# EAGLE board MSP-EXP432P401R (EAGLE 6.5.0), part 1 of 2
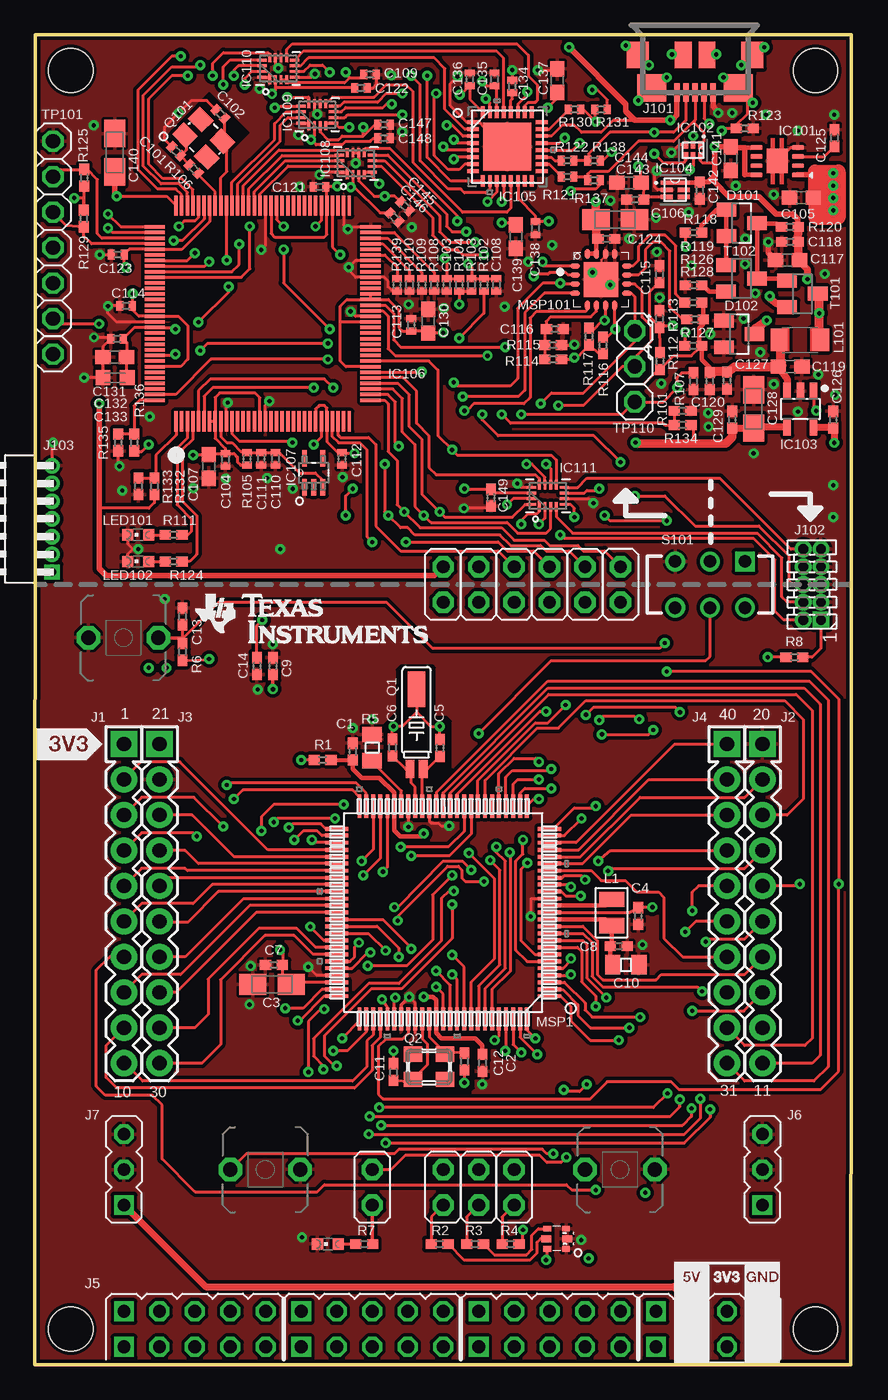
[diagram p7: board, top side]
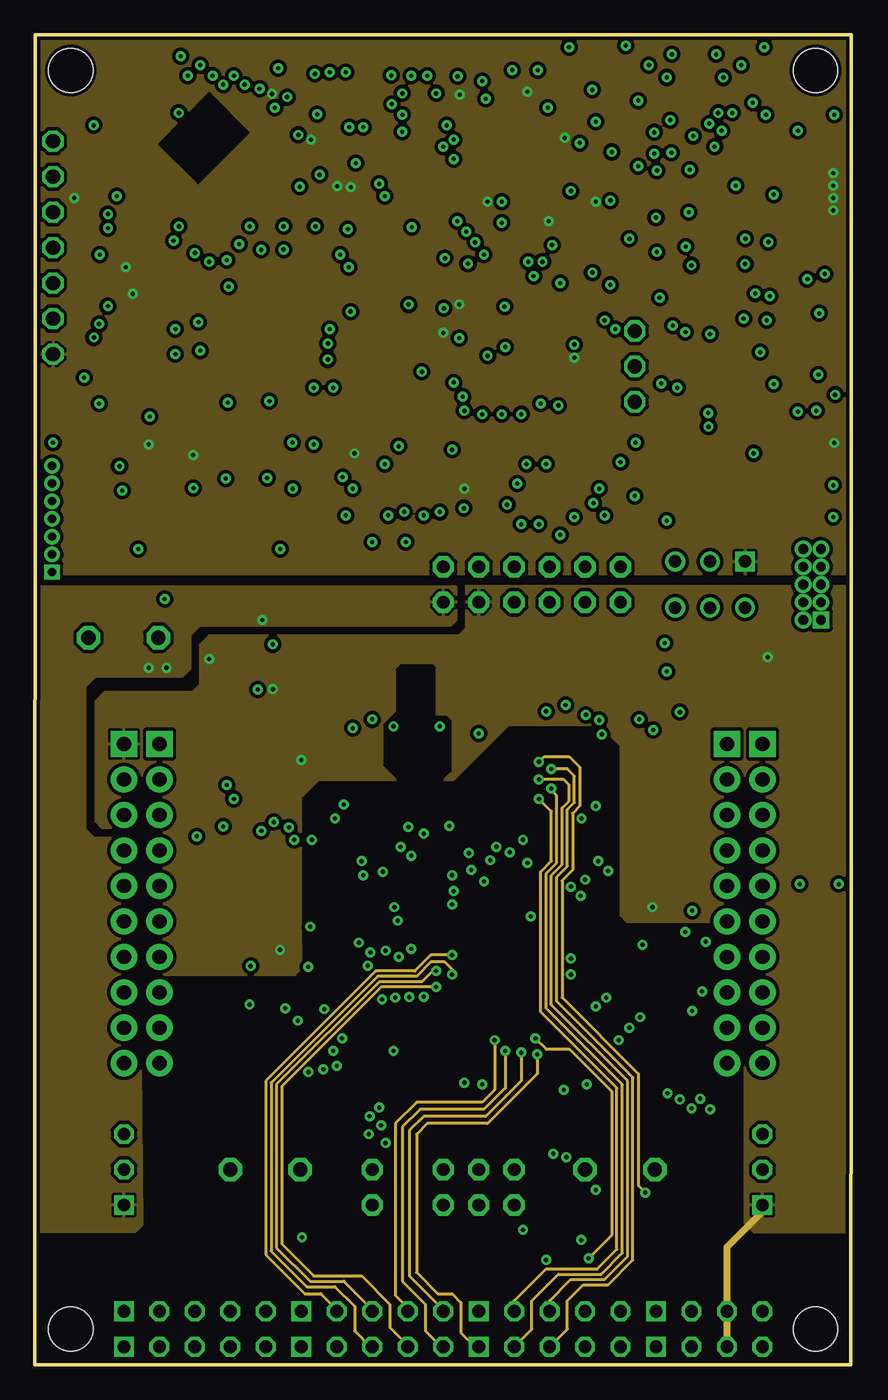
[diagram p8: board, inner layer Mid-Top]
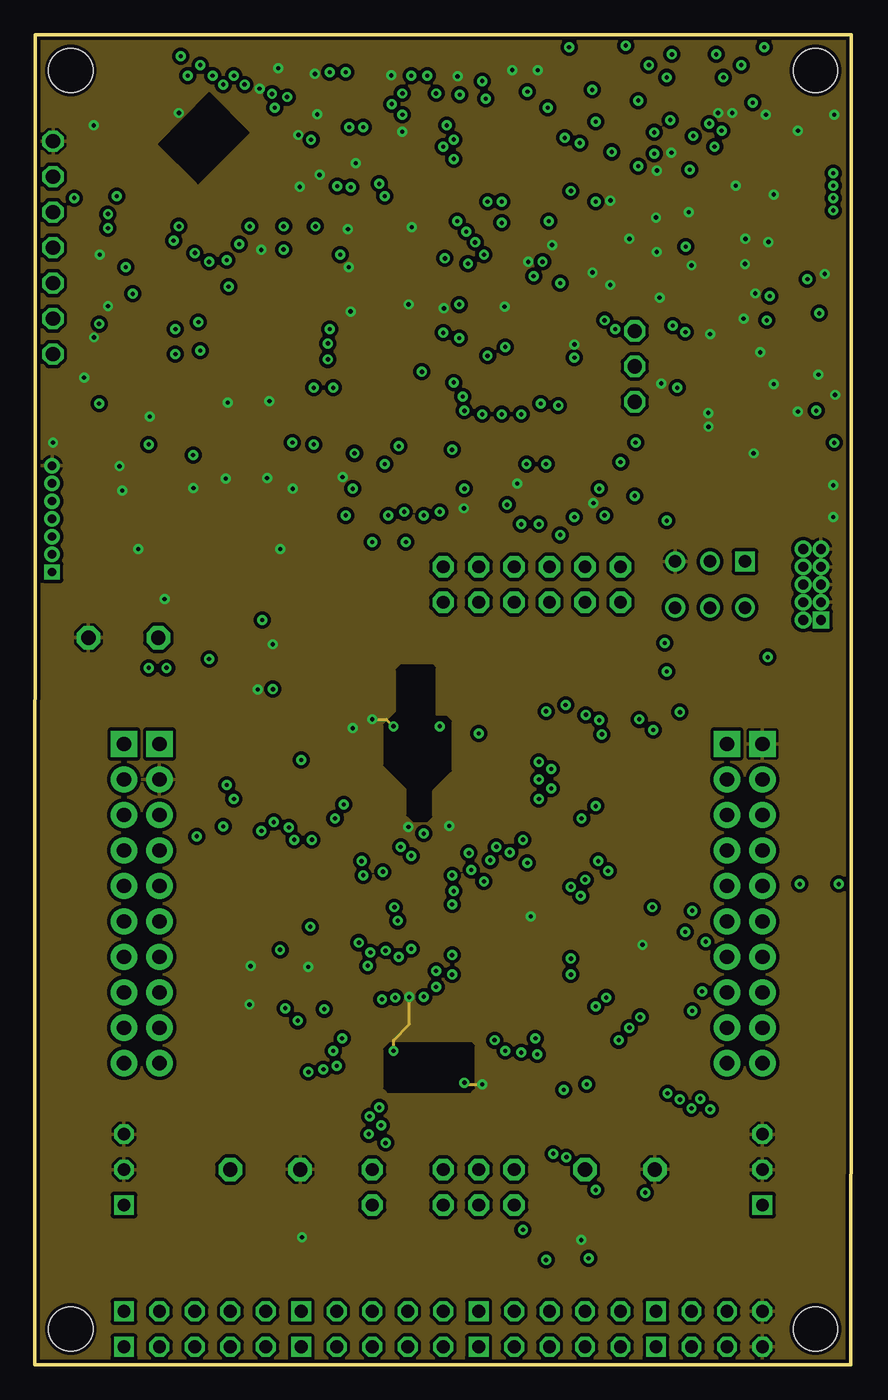
[diagram p9: board, inner layer Mid-Bottom]
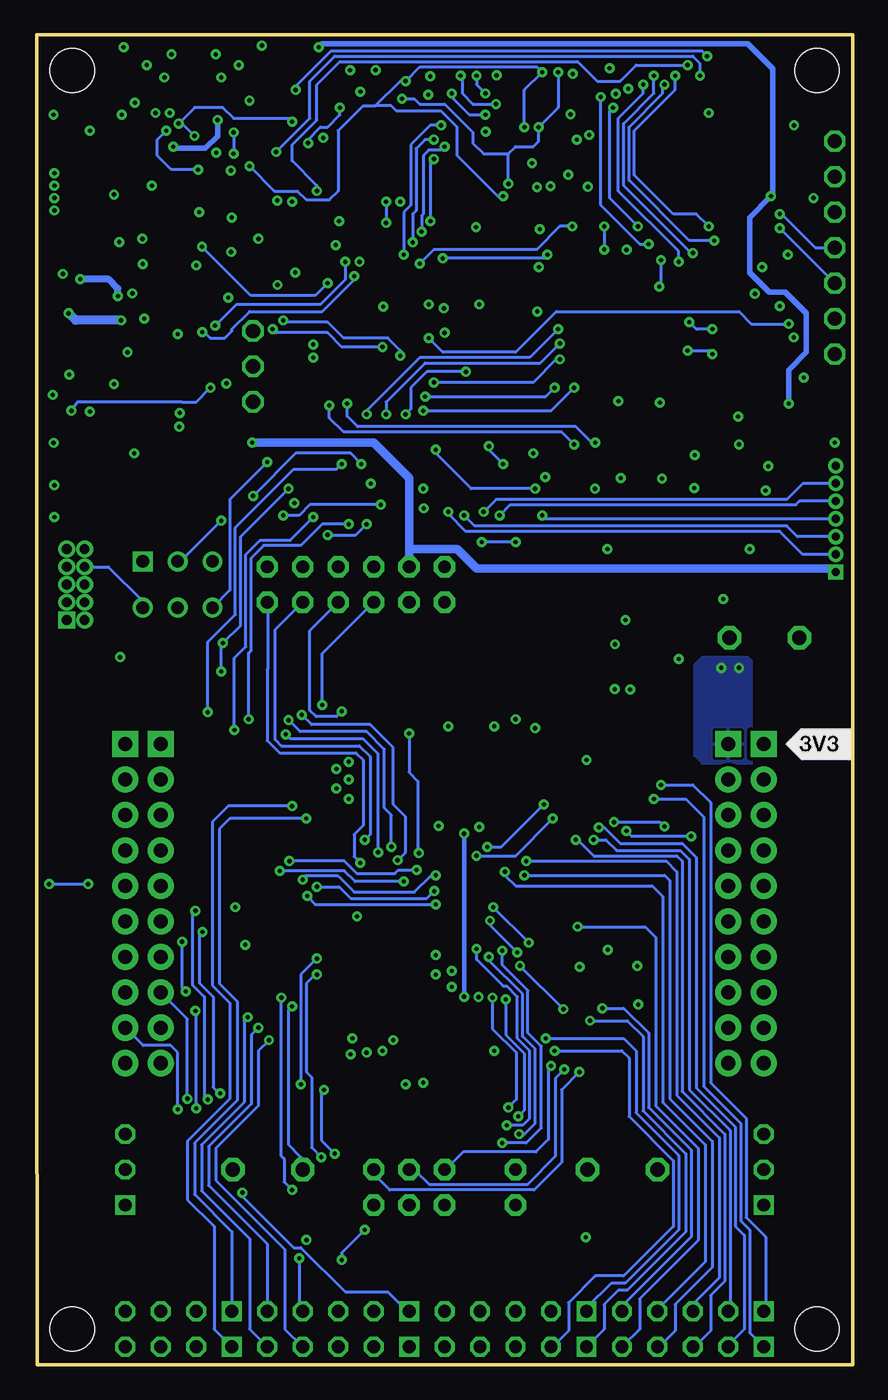
[diagram p10: board, bottom side, seen from below]

Size 58.45 x 95.25 mm. Coordinates in mm from the lower left corner, seen from the top.
Outline: 0,0 58.42,0 58.45,27.3 58.45,95.25 0.03,95.25 0,0
Copper layers (1+2*15+16): Top 0.0178mm / dielectric 12mil / Mid-Top 0.0356mm / dielectric 27mil / Mid-Bottom 0.0356mm / dielectric 12mil / Bottom 0.0178mm
Design rules "MSP430 PCBExpress 4-layer-dietmar": minimum track width 6mil, minimum drill 12mil, track to track 6mil, track to pad 6mil, pad to pad 6mil, via to via 8mil, smd to smd 6mil, copper to edge 8mil, drill to drill 8mil, minimum pad ring 10mil, minimum via ring 8mil, stop-mask expansion 8mil, vias tented up to drill 15mil, thermal gap 8mil
Net classes: 0 default: width 0.254 mm; 1 Ground: width 0.203 mm, drill 0.305 mm, clearance 0.152 mm to class 0, clearance 0.152 mm; 2 Power: width 0.203 mm, drill 0.305 mm, clearance 0.152 mm to class 0, clearance 0.152 mm to class 1, clearance 0.152 mm

## Footprints (pad centres in the part's own frame; a part is rotated, then mirrored left to right if it is on the bottom)
0402 = smd 0.8 x 0.7: 1 -0.6,0; 2 0.6,0
A/3216-18R = smd 1.95 x 1.5: + 1.375,0; - -1.375,0
CSMD0805 = smd 1.092 x 1.397: 1 -0.94,0; 2 0.94,0
C0402 = smd 0.5 x 0.7: 1 -0.45,0; 2 0.45,0
C0603 = smd 1.1 x 1: 1 -0.85,0; 2 0.85,0
C0603K = smd 1.05 x 1.08: 1 -0.875,0; 2 0.875,0
SOT23 = smd 1 x 1.4: 1 -0.95,-1.1; 2 0.95,-1.1; 3 0,1.1
SON8 = smd 0.85 x 0.35: 1 -1.475,0.975; 2 -1.475,0.325; 3 -1.475,-0.325; 4 -1.475,-0.975; 5 1.475,-0.975; 6 1.475,-0.325; 7 1.475,0.325; 8 1.475,0.975 | smd 1.5 x 1.75: 9 0,0
DRY6 = smd 0.559 x 0.305: 1 -0.356,0.508 | smd 0.508 x 0.305: 2 -0.381,0; 3 -0.381,-0.508; 4 0.381,-0.508; 5 0.381,0; 6 0.381,0.508
SOT23-5 = smd 0.55 x 1.2: 1 -1.204,-0.919; 2 -0.254,-0.919; 3 0.696,-0.919; 4 0.696,1.681; 5 -1.204,1.681
DSE6 = smd 0.965 x 0.305: 1 -0.559,0.508 | smd 0.864 x 0.305: 2 -0.61,0; 3 -0.61,-0.508; 4 0.61,-0.508; 5 0.61,0; 6 0.61,0.508
RHB32_3P45X3P45 = smd 0.838 x 0.279: 1 -2.464,1.753; 2 -2.464,1.245; 3 -2.464,0.762; 4 -2.464,0.254; 5 -2.464,-0.254; 6 -2.464,-0.762; 7 -2.464,-1.245; 8 -2.464,-1.753; 17 2.464,-1.753; 18 2.464,-1.245; 19 2.464,-0.762; 20 2.464,-0.254; 21 2.464,0.254; 22 2.464,0.762; 23 2.464,1.245; 24 2.464,1.753 | smd 0.279 x 0.838: 9 -1.753,-2.464; 10 -1.245,-2.464; 11 -0.762,-2.464; 12 -0.254,-2.464; 13 0.254,-2.464; 14 0.762,-2.464; 15 1.245,-2.464; 16 1.753,-2.464; 25 1.753,2.464; 26 1.245,2.464; 27 0.762,2.464; 28 0.254,2.464; 29 -0.254,2.464; 30 -0.762,2.464; 31 -1.245,2.464; 32 -1.753,2.464 | smd 3.454 x 3.454: 33 0,0
TQFP-128 = smd 1.45 x 0.25: P$1 0,0; P$2 0,-0.4; P$3 0,-0.8; P$4 0,-1.2; P$5 0,-1.6; P$6 0,-2; P$7 0,-2.4; P$8 0,-2.8; P$9 0,-3.2; P$10 0,-3.6; P$11 0,-4; P$12 0,-4.4; P$13 0,-4.8; P$14 0,-5.2; P$15 0,-5.6; P$16 0,-6; P$17 0,-6.4; P$18 0,-6.8; P$19 0,-7.2; P$20 0,-7.6; P$21 0,-8; P$22 0,-8.4; P$23 0,-8.8; P$24 0,-9.2; P$25 0,-9.6; P$26 0,-10; P$27 0,-10.4; P$28 0,-10.8; P$29 0,-11.2; P$30 0,-11.6; P$31 0,-12; P$32 0,-12.4; P$65 15.45,-12.4; P$66 15.45,-12; P$67 15.45,-11.6; P$68 15.45,-11.2; P$69 15.45,-10.8; P$70 15.45,-10.4; P$71 15.45,-10; P$72 15.45,-9.6; P$73 15.45,-9.2; P$74 15.45,-8.8; P$75 15.45,-8.4; P$76 15.45,-8; P$77 15.45,-7.6; P$78 15.45,-7.2; P$79 15.45,-6.8; P$80 15.45,-6.4; P$81 15.45,-6; P$82 15.45,-5.6; P$83 15.45,-5.2; P$84 15.45,-4.8; P$85 15.45,-4.4; P$86 15.45,-4; P$87 15.45,-3.6; P$88 15.45,-3.2; P$89 15.45,-2.8; P$90 15.45,-2.4; P$91 15.45,-2; P$92 15.45,-1.6; P$93 15.45,-1.2; P$94 15.45,-0.8; P$95 15.45,-0.4; P$96 15.45,0 | smd 0.25 x 1.45: P$33 1.525,-13.925; P$34 1.925,-13.925; P$35 2.325,-13.925; P$36 2.725,-13.925; P$37 3.125,-13.925; P$38 3.525,-13.925; P$39 3.925,-13.925; P$40 4.325,-13.925; P$41 4.725,-13.925; P$42 5.125,-13.925; P$43 5.525,-13.925; P$44 5.925,-13.925; P$45 6.325,-13.925; P$46 6.725,-13.925; P$47 7.125,-13.925; P$48 7.525,-13.925; P$49 7.925,-13.925; P$50 8.325,-13.925; P$51 8.725,-13.925; P$52 9.125,-13.925; P$53 9.525,-13.925; P$54 9.925,-13.925; P$55 10.325,-13.925; P$56 10.725,-13.925; P$57 11.125,-13.925; P$58 11.525,-13.925; P$59 11.925,-13.925; P$60 12.325,-13.925; P$61 12.725,-13.925; P$62 13.125,-13.925; P$63 13.525,-13.925; P$64 13.925,-13.925; P$97 13.925,1.525; P$98 13.525,1.525; P$99 13.125,1.525; P$100 12.725,1.525; P$101 12.325,1.525; P$102 11.925,1.525; P$103 11.525,1.525; P$104 11.125,1.525; P$105 10.725,1.525; P$106 10.325,1.525; P$107 9.925,1.525; P$108 9.525,1.525; P$109 9.125,1.525; P$110 8.725,1.525; P$111 8.325,1.525; P$112 7.925,1.525; P$113 7.525,1.525; P$114 7.125,1.525; P$115 6.725,1.525; P$116 6.325,1.525; P$117 5.925,1.525; P$118 5.525,1.525; P$119 5.125,1.525; P$120 4.725,1.525; P$121 4.325,1.525; P$122 3.925,1.525; P$123 3.525,1.525; P$124 3.125,1.525; P$125 2.725,1.525; P$126 2.325,1.525; P$127 1.925,1.525; P$128 1.525,1.525
DCK5 = smd 1.168 x 0.356: 1 -1.041,0.66; 2 -1.041,0; 3 -1.041,-0.66; 4 1.041,-0.66; 5 1.041,0.66
RSV16 = smd 0.762 x 0.203: 1 -0.737,0.61 | smd 0.66 x 0.203: 2 -0.787,0.203; 3 -0.787,-0.203; 4 -0.787,-0.61; 9 0.787,-0.61; 10 0.787,-0.203; 11 0.787,0.203; 12 0.787,0.61 | smd 0.203 x 0.66: 5 -0.61,-1.168; 6 -0.203,-1.168; 7 0.203,-1.168; 8 0.61,-1.168; 13 0.61,1.168; 14 0.203,1.168; 15 -0.203,1.168; 16 -0.61,1.168
1X10 = drill 1.016 pad 1.88 square: 1 0,10.16 | drill 1.016 pad 1.88: 2 0,7.62; 3 0,5.08; 4 0,2.54; 5 0,0; 6 0,-2.54; 7 0,-5.08; 8 0,-7.62; 9 0,-10.16; 10 0,-12.7
1X10-J2 = drill 1.016 pad 1.88: 11 0,-12.7; 12 0,-10.16; 13 0,-7.62; 14 0,-5.08; 15 0,-2.54; 16 0,0; 17 0,2.54; 18 0,5.08; 19 0,7.62 | drill 1.016 pad 1.88 square: 20 0,10.16
1X10-J3 = drill 1.016 pad 1.88 square: 21 0,10.16 | drill 1.016 pad 1.88: 22 0,7.62; 23 0,5.08; 24 0,2.54; 25 0,0; 26 0,-2.54; 27 0,-5.08; 28 0,-7.62; 29 0,-10.16; 30 0,-12.7
1X10-J4 = drill 1.016 pad 1.88: 31 0,-12.7; 32 0,-10.16; 33 0,-7.62; 34 0,-5.08; 35 0,-2.54; 36 0,0; 37 0,2.54; 38 0,5.08; 39 0,7.62 | drill 1.016 pad 1.88 square: 40 0,10.16
BOTTOM_CONNECTOR = drill 0.914 square: 1 -24.13,-1.27; 2 -24.13,1.27; 11 -11.43,-1.27; 12 -11.43,1.27; 21 1.27,-1.27; 22 1.27,1.27; 31 13.97,-1.27; 32 13.97,1.27 | drill 0.914 octagon: 3 -21.59,-1.27; 4 -21.59,1.27; 5 -19.05,-1.27; 6 -19.05,1.27; 7 -16.51,-1.27; 8 -16.51,1.27; 9 -13.97,-1.27; 10 -13.97,1.27; 13 -8.89,-1.27; 14 -8.89,1.27; 15 -6.35,-1.27; 16 -6.35,1.27; 17 -3.81,-1.27; 18 -3.81,1.27; 19 -1.27,-1.27; 20 -1.27,1.27; 23 3.81,-1.27; 24 3.81,1.27; 25 6.35,-1.27; 26 6.35,1.27; 27 8.89,-1.27; 28 8.89,1.27; 29 11.43,-1.27; 30 11.43,1.27; 33 16.51,-1.27; 34 16.51,1.27; 35 19.05,-1.27; 36 19.05,1.27; 37 21.59,-1.27; 38 21.59,1.27
JP3 = drill 0.914 square: 1 -2.54,0 | drill 0.914 octagon: 2 0,0; 3 2.54,0
HIROSE-ZX62R-B-5P = smd 1.35 x 0.4: D+ 2.675,0; D- 2.675,-0.65; GND 2.675,1.3; NC 2.675,0.65; VBUS 2.675,-1.3 | smd 1.9 x 1.6: SHIELD1 0,4.1; SHIELD2 0,-4.1 | smd 2 x 2.1: SHIELD3 2.35,3.1; SHIELD4 2.35,-3.1 | smd 1.9 x 1.2: SHIELD5 0,0.85; SHIELD6 0,-0.85
EXTERNAL_DEBUG = drill 0.7 pad 0.93 square: 1 -2.54,-0.635 | drill 0.7 pad 0.93: 2 -2.54,0.635; 3 -1.27,-0.635; 4 -1.27,0.635; 5 0,-0.635; 6 0,0.635; 7 1.27,-0.635; 8 1.27,0.635; 9 2.54,-0.635; 10 2.54,0.635
XDSET_DEBUG = drill 0.6 pad 0.838 square: 1 -3.17,0.07 | drill 0.6 pad 0.838: 2 -1.91,0.07; 3 -0.63,0.07; 4 0.63,0.07; 5 1.91,0.07; 6 3.18,0.07; 7 4.45,0.07
JP1M = drill 0.914 pad 1.524 octagon: 1 0,-1.27; 2 0,1.27
0806 = smd 1.1 x 1.8: 1 -0.94,0; 2 0.94,0
L3216C = smd 1.2 x 1.6: 1 -1.5,0; 2 1.5,0
CHIPLED_0603 = smd 0.8 x 0.8: A 0,-0.75; C 0,0.75
RGB_LED = smd 0.55 x 0.4: 1 -0.675,0.725; 3 -0.675,-0.725; 4 0.675,0.725; 6 0.675,-0.725 | smd 0.7 x 0.5: 2 -0.75,0; 5 0.75,0
PZ100 = smd 1.676 x 0.279: 1 -7.62,5.994; 2 -7.62,5.512; 3 -7.62,5.004; 4 -7.62,4.496; 5 -7.62,3.988; 6 -7.62,3.505; 7 -7.62,2.997; 8 -7.62,2.489; 9 -7.62,2.007; 10 -7.62,1.499; 11 -7.62,0.991; 12 -7.62,0.508; 13 -7.62,0; 14 -7.62,-0.508; 15 -7.62,-0.991; 16 -7.62,-1.499; 17 -7.62,-2.007; 18 -7.62,-2.489; 19 -7.62,-2.997; 20 -7.62,-3.505; 21 -7.62,-3.988; 22 -7.62,-4.496; 23 -7.62,-5.004; 24 -7.62,-5.512; 25 -7.62,-5.994; 51 7.62,-5.994; 52 7.62,-5.512; 53 7.62,-5.004; 54 7.62,-4.496; 55 7.62,-3.988; 56 7.62,-3.505; 57 7.62,-2.997; 58 7.62,-2.489; 59 7.62,-2.007; 60 7.62,-1.499; 61 7.62,-0.991; 62 7.62,-0.508; 63 7.62,0; 64 7.62,0.508; 65 7.62,0.991; 66 7.62,1.499; 67 7.62,2.007; 68 7.62,2.489; 69 7.62,2.997; 70 7.62,3.505; 71 7.62,3.988; 72 7.62,4.496; 73 7.62,5.004; 74 7.62,5.512; 75 7.62,5.994 | smd 0.279 x 1.676: 26 -5.994,-7.62; 27 -5.512,-7.62; 28 -5.004,-7.62; 29 -4.496,-7.62; 30 -3.988,-7.62; 31 -3.505,-7.62; 32 -2.997,-7.62; 33 -2.489,-7.62; 34 -2.007,-7.62; 35 -1.499,-7.62; 36 -0.991,-7.62; 37 -0.508,-7.62; 38 0,-7.62; 39 0.508,-7.62; 40 0.991,-7.62; 41 1.499,-7.62; 42 2.007,-7.62; 43 2.489,-7.62; 44 2.997,-7.62; 45 3.505,-7.62; 46 3.988,-7.62; 47 4.496,-7.62; 48 5.004,-7.62; 49 5.512,-7.62; 50 5.994,-7.62; 76 5.994,7.62; 77 5.512,7.62; 78 5.004,7.62; 79 4.496,7.62; 80 3.988,7.62; 81 3.505,7.62; 82 2.997,7.62; 83 2.489,7.62; 84 2.007,7.62; 85 1.499,7.62; 86 0.991,7.62; 87 0.508,7.62; 88 0,7.62; 89 -0.508,7.62; 90 -0.991,7.62; 91 -1.499,7.62; 92 -2.007,7.62; 93 -2.489,7.62; 94 -2.997,7.62; 95 -3.505,7.62; 96 -3.988,7.62; 97 -4.496,7.62; 98 -5.004,7.62; 99 -5.512,7.62; 100 -5.994,7.62
RSA16 = smd 0.7 x 0.35: 1 -1.85,0.975; 2 -1.85,0.325; 3 -1.85,-0.325; 4 -1.85,-0.975; 9 1.85,-0.975; 10 1.85,-0.325; 11 1.85,0.325; 12 1.85,0.975 | smd 0.35 x 0.7: 5 -0.975,-1.85; 6 -0.325,-1.85; 7 0.325,-1.85; 8 0.975,-1.85; 13 0.975,1.85; 14 0.325,1.85; 15 -0.325,1.85; 16 -0.975,1.85 | smd 2.5 x 2.5: TP 0,0
MS3V-T1R = smd 0.635 x 1.27: P1 -0.47,-4.43; P2 0.47,-4.43 | smd 1.27 x 2.54: P3 0,1.3
KX-7 = smd 1.3 x 1.1: 1 -1.15,-0.9; 2 1.15,-0.9; 3 1.15,0.9; 4 -1.15,0.9
NX3225GA = smd 1.4 x 1.2: 1 0,0; 2 2.2,0; 3 2.2,1.6; 4 0,1.6
0805 = smd 1.092 x 1.397: 1 -0.94,0; 2 0.94,0
R0402 = smd 0.5 x 0.7: 1 -0.45,0; 2 0.45,0
PBTH = drill 1.016 pad 1.676 octagon: 1 -0.001,0.001; 2 5.001,0.001
M096V_DPDT = drill 0.9 square: 1 -2.5,-3.3 | drill 0.9: 2 0,-3.3; 3 2.5,-3.3; 4 -2.5,0; 5 0,0; 6 2.5,0
SOT23-BEC = smd 1 x 1.4: B -0.95,-1.1; C 0,1.1; E 0.95,-1.1
1X01 = drill 1.016 octagon: 1 0,0
MOUNTHOLE_125MIL = hole 3.175: 0,0

## Placement (x,y rotation side)
C1  100n  [0402]  22.76,43.92 90 top
C2  100n  [0402]  32.05,21.62 270 top
C3  10u  [A/3216-18R]  16.98,27.24 0 top
C4  100n  [0402]  43.21,32.13 270 top
C5  12p  [0402]  29.01,44.17 90 top
C6  12p  [0402]  25.6,44.2 90 top
C7  100n  [0402]  17.11,28.64 180 top
C8  100n  [0402]  41.81,29.97 0 top
C9  100n  [0402]  17.04,50.04 270 top
C10  4u7  [CSMD0805]  42.32,28.64 0 top
C11  22p  [0402]  25.68,20.96 90 top
C12  22p  [0402]  30.76,21.72 270 top
C13  1n  [0402]  10.57,53.59 90 top
C14  100n  [0402]  15.9,50.04 90 top
C101  12pF  [C0402]  10.11,86.92 135 top
C102  12pF  [C0402]  13.28,89.59 135 top
C103  0.1uF  [C0402]  29.49,77.34 270 top
C104  10n  [C0402]  13.64,64.82 270 top
C105  2u2  [C0603]  54.89,83.59 180 top
C106  4.7u  [A/3216-18R]  41.55,82.01 180 top
C107  1u  [C0603]  12.45,64.34 270 top
C108  DNP  [C0402]  33.05,77.34 270 top
C109  10n  [C0402]  23.98,92.41 0 top
C110  10n  [C0402]  17.22,64.87 270 top
C111  100n  [C0402]  16.21,64.87 270 top
C112  10n  [C0402]  22,64.9 270 top
C113  100n  [C0402]  26.95,74.49 90 top
C114  10n  [C0402]  6.52,75.84 180 top
C115  33p  [0402]  44.73,78.1 270 top
C116  33p  [0402]  37.24,74.17 180 top
C117  4.7u  [C0603]  53.89,79.13 180 top
C118  100n  [0402]  54.07,80.43 180 top
C119  4.7u  [C0603]  54.08,71.49 0 top
C120  100n  [0402]  48.32,70.45 270 top
C121  100n  [C0402]  20.37,84.36 180 top
C122  10n  [C0402]  23.35,91.45 0 top
C123  10n  [C0402]  5.93,79.5 180 top
C124  100n  [0402]  40.92,80.65 0 top
C125  10n  [0402]  57.25,87.86 90 top
C126  220n  [0402]  57.18,67.69 90 top
C127  220n  [0402]  49.56,70.48 270 top
C128  47u  [A/3216-18R]  51.46,68.45 270 top
C129  100n  [0402]  49.94,67.69 90 top
C130  1u  [C0603]  28.16,74.74 270 top
C131  0.1uF  [C0402]  5.87,73.48 180 top
C132  1u  [C0603]  5.71,72.16 0 top
C133  2.2uF  [C0603K]  5.74,70.69 180 top
C134  100n  [C0402]  34.19,91.57 90 top
C135  100n  [C0402]  32.92,92.08 90 top
C136  100n  [C0402]  31.14,92.08 90 top
C137  2u2  [C0603]  37.4,91.97 90 top
C138  100n  [C0402]  35.84,81.41 270 top
C139  2u2  [C0603]  34.44,80.8 270 top
C140  4.7u  [A/3216-18R]  5.71,86.82 270 top
C141  1u  [C0603]  49.83,86.39 270 top
C142  100n  [0402]  47.6,84.1 270 top
C143  100n  [0402]  42.99,83.45 180 top
C144  2u2  [C0603]  42.55,84.66 180 top
C145  10n  [C0402]  26.5,82.98 315 top
C146  10n  [C0402]  25.72,82.18 315 top
C147  10n  [C0402]  25,88.81 0 top
C148  10n  [C0402]  25,87.85 0 top
C149  100n  [0402]  32.66,62.1 270 top
D101  BAS40-05  [SOT23]  50.61,81.77 270 top
D102  BAS40-05  [SOT23]  50.44,73.82 270 top
DRAW3  [LOGO-ROCKET-10X7MM-BRD]  14.34,43.13 7 top
IC101  TPS73533DRB  [SON8]  53.16,86.21 180 top
IC102  TPD4E004_DRY_6  [DRY6]  47.13,86.99 270 top
IC103  TPS2102DBV  [SOT23-5]  54.56,68.83 180 top
IC104  TLV70018_DSE_6  [DSE6]  45.85,84.15 0 top
IC105  TUSB1210_RHB_32  [RHB32_3P45X3P45]  33.83,87.25 0 top
IC106  TM4C129ENCPDT  [TQFP-128]  10.11,67.56 90 top
IC107  LM4040B25_DCK_5  [DCK5]  19.96,63.88 90 top
IC108  SN74AVC4T245_RSV_16  [RSV16]  22.98,86.03 90 top
IC109  SN74AVC4T245_RSV_16  [RSV16]  20.22,89.54 90 top
IC110  SN74AVC4T245_RSV_16  [RSV16]  17.42,92.84 90 top
IC111  SN74CBTLV3257_RSV_16  [RSV16]  36.73,62.23 90 top
J1  [1X10]  6.38,34.29 0 top
J2  [1X10-J2]  52.1,34.29 0 top
J3  [1X10-J3]  8.92,34.29 0 top
J4  [1X10-J4]  49.56,34.29 0 top
J5  EDGE_CON  [BOTTOM_CONNECTOR]  30.51,2.54 0 top
J6  3V3  [JP3]  52.1,13.97 90 top
J7  5V  [JP3]  6.38,13.97 90 top
J101  [HIROSE-ZX62R-B-5P]  47.27,93.8 270 top
J102  EXTERNAL_DEBUG_CON  [EXTERNAL_DEBUG]  55.65,55.88 90 top
J103  XDSET_DEBUG_CON  [XDSET_DEBUG]  1.3,59.94 90 top
JP2  +5V  [JP1M]  29.24,55.88 180 top
JP3  +3V3  [JP1M]  31.78,55.88 180 top
JP4.1  RTS  [JP1M]  34.32,55.88 180 top
JP4.2  CTS  [JP1M]  36.86,55.88 180 top
JP4.3  RXD  [JP1M]  39.4,55.88 180 top
JP4.4  TXD  [JP1M]  41.94,55.88 180 top
JP8  LED1  [JP1M]  24.16,12.7 180 top
JP9  LED2_RED  [JP1M]  29.24,12.7 180 top
JP10  LED2_GREEN  [JP1M]  31.78,12.7 180 top
JP11  LED2_BLUE  [JP1M]  34.32,12.7 180 top
L1  4.7uH  [0806]  41.3,32.38 90 top
L101  2u2  [L3216C]  54.78,73.4 180 top
LED1  [CHIPLED_0603]  20.98,8.64 90 top
LED2  EVERLIGHT_19-337  [RGB_LED]  37.36,9.02 180 top
LED101  [CHIPLED_0603]  7.39,59.44 90 top
LED102  [CHIPLED_0603]  7.39,57.53 90 top
MSP1  MSP432  [PZ100]  29.24,32.38 180 top
MSP101  MSP430G2452IRSA16R  [RSA16]  40.54,77.72 0 top
Q1  32.768kHz  [MS3V-T1R]  27.33,47.09 0 top
Q2  KX-7 48MHz  [KX-7]  28.22,21.34 0 top
Q101  NX3225GA_OSC  [NX3225GA]  10.74,88.06 315 top
R1  0R  [0402]  20.6,43.31 0 top
R2  110R  [0402]  28.98,8.64 0 top
R3  16R  [0402]  31.52,8.64 0 top
R4  24R  [0402]  34.06,8.64 0 top
R5  91kOhm, 0.1%, 25ppm/C  [0805]  24.16,44.2 90 top
R6  47k  [0402]  10.57,51.05 270 top
R7  470  [0402]  23.58,8.64 180 top
R8  1k  [0402]  54.38,50.67 0 top
R101  DNP  [0402]  46.38,68.33 180 top
R102  100  [R0402]  32.16,77.34 90 top
R103  10k  [R0402]  31.27,77.34 90 top
R104  51  [R0402]  30.38,77.34 90 top
R105  1k 1%  [R0402]  15.19,64.87 270 top
R106  2R  [R0402]  11.38,85.65 315 top
R107  47k  [0402]  47.16,70.44 270 top
R108  1k  [R0402]  28.6,77.34 90 top
R109  1k  [R0402]  27.71,77.34 90 top
R110  1k  [R0402]  26.82,77.34 90 top
R111  470  [0402]  9.93,59.44 180 top
R112  220k  [0402]  44.76,71.88 90 top
R113  220k  [0402]  44.73,74.9 90 top
R114  220k  [0402]  37.11,72.01 180 top
R115  220k  [0402]  37.11,73.02 0 top
R116  4k7  [0402]  40.68,73.01 90 top
R117  4k7  [0402]  39.68,73.65 90 top
R118  820  [0402]  47.16,81.09 180 top
R119  0  [0402]  47.16,77.31 180 top
R120  470  [0402]  54.06,81.5 180 top
R121  DNP  [R0402]  38.13,85.09 0 top
R122  DNP  [R0402]  38.13,86.23 0 top
R123  33  [0402]  50.83,88.56 0 top
R124  470  [0402]  9.93,57.53 180 top
R125  10k  [0402]  3.53,85.01 270 top
R126  2k2  [0402]  47.14,76.07 180 top
R127  3k3  [0402]  47.14,72.97 180 top
R128  6k8  [0402]  47.27,74.88 180 top
R129  10k  [0402]  3.51,82.09 90 top
R130  DNP  [R0402]  38.63,89.92 180 top
R131  0  [R0402]  40.54,89.92 0 top
R132  330k  [0402]  8.56,62.92 90 top
R133  220k  [0402]  7.42,62.92 90 top
R134  DNP  [0402]  46.38,67.31 180 top
R135  220k  [0402]  7.11,66.05 90 top
R136  220k  [0402]  5.97,66.05 90 top
R137  0  [R0402]  40.03,84.84 0 top
R138  0  [R0402]  40.03,86.23 0 top
R139  dnp  [R0402]  25.93,77.34 90 top
S1  [PBTH]  14,13.97 0 top
S2  [PBTH]  39.4,13.97 0 top
S3  RST  [PBTH]  3.84,52.07 0 top
S101  M096V_DPDT  [M096V_DPDT]  48.35,54.23 180 top
T101  DMG1013UW  [SOT23]  54.96,76.7 270 top
T102  BC850CW-115  [SOT23-BEC]  50.6,77.8 270 top
TP101  TEST_PIN2  [1X01]  1.3,87.63 270 top
TP102  TEST_PIN2  [1X01]  1.3,85.09 270 top
TP103  TEST_PIN2  [1X01]  1.3,82.55 270 top
TP104  TEST_PIN2  [1X01]  1.3,80.01 270 top
TP105  TEST_PIN2  [1X01]  1.3,77.47 270 top
TP106  TEST_PIN2  [1X01]  1.3,74.93 270 top
TP107  TEST_PIN2  [1X01]  1.3,72.39 0 top
TP108  TEST_PIN2  [1X01]  42.95,74.04 0 top
TP109  TEST_PIN2  [1X01]  42.95,71.5 0 top
TP110  TEST_PIN2  [1X01]  42.95,68.96 0 top
U$1  MOUNTHOLE_125MIL  [MOUNTHOLE_125MIL]  2.57,2.54 0 top
U$2  MOUNTHOLE_125MIL  [MOUNTHOLE_125MIL]  55.91,2.54 0 top
U$3  MOUNTHOLE_125MIL  [MOUNTHOLE_125MIL]  2.57,92.71 0 top
U$4  [LOGO16_TPLACE]  11.39,51.51 0 top
U$5  MOUNTHOLE_125MIL  [MOUNTHOLE_125MIL]  55.91,92.71 0 top
U$6  SILK_HEADER_LABEL  [SILK_HEADER_LABEL]  45.8,0 0 top
U$7  SILK_3V3_TAG  [SILK_3V3_TAG]  0.03,43.31 0 top
U$8  SILK_P401R_REAR  [SILK_P401R_REAR]  0.03,0 0 top